# Altium project ProjetPCB.PrjPcb
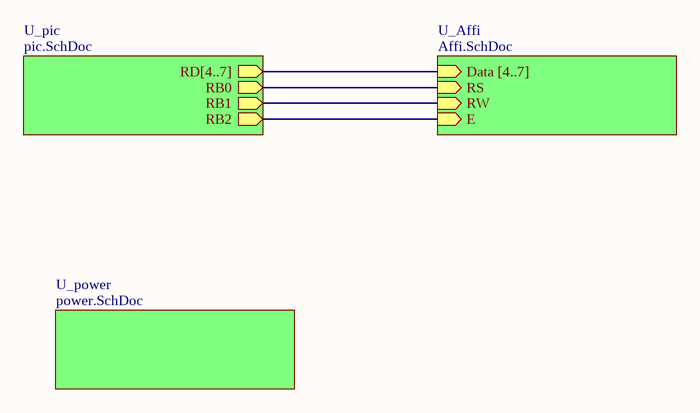
[diagram p0: temp.SchDoc]
4 sheets, 33 parts. Net scope: hierarchical (ports join the sheet entries above them; power ports are global).
Board file: PCB.PcbDoc
Sheets:
  temp.SchDoc
    U_pic = pic.SchDoc
    U_Affi = Affi.SchDoc
    U_power = power.SchDoc

## Sheet temp.SchDoc
size A4

### Sub-sheets
U_Affi = Affi.SchDoc: RS (in), RW (in), E (in), Data [4..7] (in)
U_pic = pic.SchDoc: RD[4..7] (out), RB0 (out), RB1 (out), RB2 (out)
U_power = power.SchDoc: no entries

### Nets
RB0: sheet U_pic/RB0, sheet U_Affi/RS
RB1: sheet U_pic/RB1, sheet U_Affi/RW
RB2: sheet U_pic/RB2, sheet U_Affi/E

### Buses and harness runs
bus sheet U_Affi/Data [4..7] = sheet U_pic/RD[4..7]

## Sheet pic.SchDoc
size A4
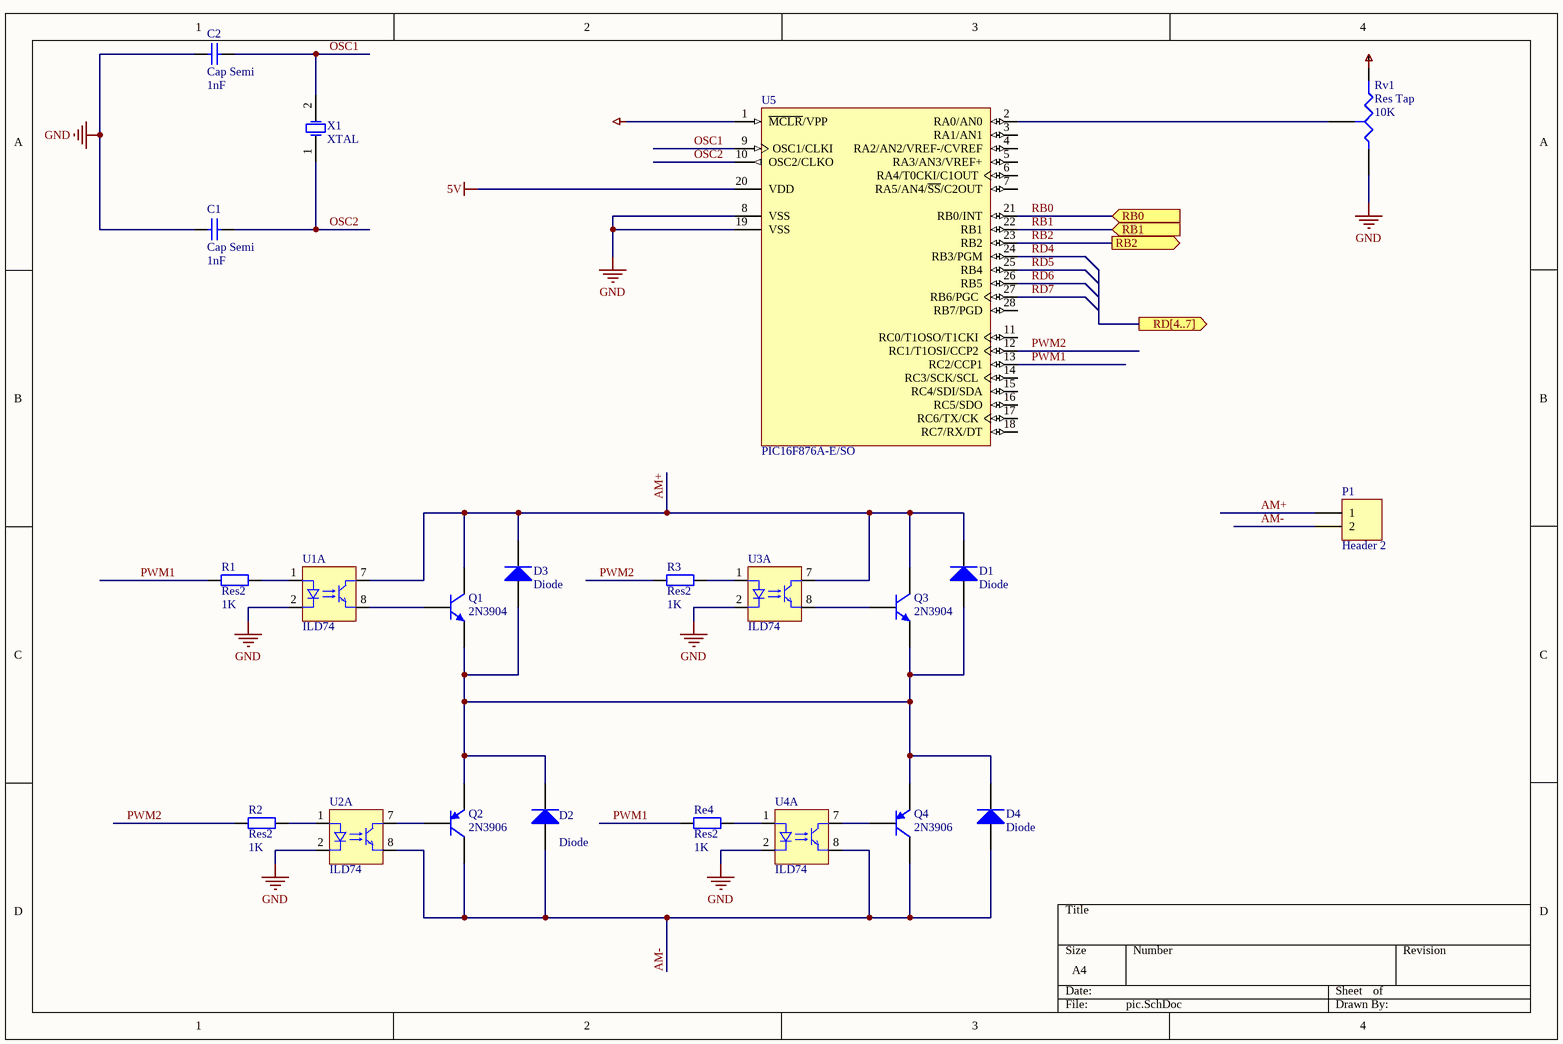
[diagram p1: pic.SchDoc]

### Parts
C1  Cap Semi  value 1nF  [C1206]
C2  Cap Semi  value 1nF  [C1206]
D1  Diode  [SMC]
D2  Diode  [SMC]
D3  Diode  [SMC]
D4  Diode  [SMC]
P1  Header 2  [HDR1X2]
Q1  2N3904  [TO-92A]
Q2  2N3906  [TO-92A]
Q3  2N3904  [TO-92A]
Q4  2N3906  [TO-92A]
R1  Res2  value 1K  [AXIAL-0.4]
R2  Res2  value 1K  [AXIAL-0.4]
R3  Res2  value 1K  [AXIAL-0.4]
Re4  Res2  value 1K  [AXIAL-0.4]
Rv1  Res Tap  value 10K  [VR3]
U1  ILD74  [DIP8]  (part A of 2)
U2  ILD74  [DIP8]  (part A of 2)
U3  ILD74  [DIP8]  (part A of 2)
U4  ILD74  [DIP8]  (part A of 2)
U5  PIC16F876A-E/SO  [SOIC-SO28_N]
X1  XTAL  [R38]

### Ports
RB0 (in), RB1 (in), RB2 (out), RD[4..7] (out)

### Nets
5V: U5.20(VDD)
GND: C1.1 C2.1 Rv1.1(A) U1.2(K) U2.2(K) U3.2(K) U4.2(K) U5.8(VSS) U5.19(VSS)
AM+: D1.2(K) D3.2(K) P1.1 Q1.3(C) Q3.3(C) U1.7(C) U3.7(C)
AM-: D2.1(A) D4.1(A) P1.2 Q2.3(C) Q4.3(C) U2.8(E) U4.8(E)
OSC1: C2.2 U5.9(OSC1/CLKI) X1.2(OSC2)
OSC2: C1.2 U5.10(OSC2/CLKO) X1.1(OSC1)
PWM1: R1.1 Re4.1 U5.13(RC2/CCP1)
PWM2: R2.1 R3.1 U5.12(RC1/T1OSI/CCP2)
RB0: U5.21(RB0/INT) ; port RB0
RB1: U5.22(RB1) ; port RB1
RB2: U5.23(RB2) ; port RB2
RD4: U5.24(RB3/PGM)
RD5: U5.25(RB4)
RD6: U5.26(RB5)
RD7: U5.27(RB6/PGC)
NetD1_1: D1.1(A) D2.2(K) D3.1(A) D4.2(K) Q1.1(E) Q2.1(E) Q3.1(E) Q4.1(E)
NetQ1_2: Q1.2(B) U1.8(E)
NetQ2_2: Q2.2(B) U2.7(C)
NetQ3_2: Q3.2(B) U3.8(E)
NetQ4_2: Q4.2(B) U4.7(C)
NetR1_2: R1.2 U1.1(A)
NetR2_2: R2.2 U2.1(A)
NetR3_2: R3.2 U3.1(A)
NetRe4_2: Re4.2 U4.1(A)
NetRv1_3: Rv1.3(TAP) U5.2(RA0/AN0)

Not connected (* = marked no-connect by the designer): Rv1 2(B); U5 1(~{MCLR}/VPP) 3(RA1/AN1) 4(RA2/AN2/VREF-/CVREF) 5(RA3/AN3/VREF+) 6(RA4/T0CKI/C1OUT) 7(RA5/AN4/~{SS}/C2OUT) 11(RC0/T1OSO/T1CKI) 14(RC3/SCK/SCL) 15(RC4/SDI/SDA) 16(RC5/SDO) 17(RC6/TX/CK) 18(RC7/RX/DT) 28(RB7/PGD)

### Library data of the parts
C1 C2 = Cap Semi: Capacitor (Semiconductor SIM Model); Published: 8-Jun-2000; LatestRevisionDate: 29-May-2009; LatestRevisionNote: IPC-7351 Footprint Added.; PackageReference: C1206; Publisher: Altium Limited; PackageDescription: Chip Capacitor
D1-D4 = Diode: Default Diode; Published: 8-Jun-2000; LatestRevisionDate: 17-Jul-2002; LatestRevisionNote: Re-released for DXP Platform.; PackageVersion: Sep-1996; PackageReference: SMC; Publisher: Altium Limited; PackageDescription: DO-214-AB/SMC; 2 C-Bend Leads; Body 7.9 x 5.9 mm, inc. leads (LxW); Code_JEDEC: DO-214-AB
P1 = Header 2: Header, 2-Pin; LatestRevisionDate: 17-Jul-2002; LatestRevisionNote: Re-released for DXP Platform.; Publisher: Altium Limited
Q1 Q3 = 2N3904: NPN General Purpose Amplifier; Published: 8-Jun-2000; LatestRevisionDate: 15-Jan-2003; LatestRevisionNote: PCB Footprint 'BCY-W3/D4.7' replaced; DatasheetVersion: 1997; PackageVersion: Sep-1998; PackageReference: TO-92A; Publisher: Altium Limited; PackageDescription: TO, Flat Index; 3 In-Line, Axial Leads; Body Dia. 4.5mm; Leads 0.51 x 0.48 mm (max); ComponentLink1Description: Manufacturer Link; ComponentLink1URL: http://www.fairchildsemi.com/; ComponentLink2Description: Datasheet; ComponentLink2URL: http://www.fairchildsemi.com/ds/2N%2F2N3904.pdf
Q2 Q4 = 2N3906: PNP General Purpose Amplifier; Published: 8-Jun-2000; LatestRevisionDate: 15-Jan-2003; LatestRevisionNote: PCB Footprint 'BCY-W3/D4.7' replaced; DatasheetVersion: 1997; PackageVersion: Sep-1998; PackageReference: TO-92A; Publisher: Altium Limited; PackageDescription: TO, Flat Index; 3 In-Line, Axial Leads; Body Dia. 4.5mm; Leads 0.51 x 0.48 mm (max); ComponentLink1Description: Manufacturer Link; ComponentLink1URL: http://www.fairchildsemi.com/; ComponentLink2Description: Datasheet; ComponentLink2URL: http://www.fairchildsemi.com/ds/2N%2F2N3906.pdf
R1-R3 Re4 = Res2: Resistor; Published: 8-Jun-2000; LatestRevisionDate: 17-Jul-2002; LatestRevisionNote: Re-released for DXP Platform.; PackageReference: AXIAL-0.4; Publisher: Altium Limited; PackageDescription: Axial Device, Thru-Hole; 2 Leads; 0.4 in Pin Spacing
Rv1 = Res Tap: Tapped Resistor; Sim Note: Enter the Resistance value and the set point into parameter fields.; Set Position: 0.5; Published: 24-Mar-1999; LatestRevisionDate: 17-Jul-2002; LatestRevisionNote: Re-released for DXP Platform.; PackageReference: VR3; Publisher: Altium Limited; PackageDescription: Variable Resistor, Thru-Hole; 3 Leads
U1-U4 = ILD74: Optocoupler, Phototransistor Output, Dual Channel, TTL Compatible, Pb-free; Note: Coupling Capacitance, 0.5 pF; Note: Transfer Ratio, 35 % Typical; Published: 6-Oct-2005; DatasheetDocument: Rev. 1.4, Oct-2004; PackageDocument: Dec-2003; PackageReference: DIP8; Publisher: Altium Limited; ComponentLink1Description: Manufacturer Link; ComponentLink1URL: http://www.vishay.com/optocouplers/list/product-83640/; ComponentLink2Description: Datasheet; ComponentLink2URL: http://www.vishay.com/docs/83640/83640.pdf
U5 = PIC16F876A-E/SO: Enhanced FLASH Microcontroller, 8K (x14-Bit words) FLASH, 368 Bytes RAM, 28-Pin SOIC, Standard VDD Range, Extended Temperature; ComponentAvailability: Unknown. Contact manufacturer to determine status.; Published: 11-Oct-2004; LatestRevisionDate: 29-Jan-2009; LatestRevisionNote: Sch. layout revised. 3D Model Removed.; DatasheetVersion: revB, Oct-2003; PackageVersion: revBB, Aug-2009; PackageReference: SOIC-SO28; Publisher: Altium Limited; PackageDescription: 28-Lead Plastic Small Outline (SO) - Wide 7.50mm Body [SOIC]; Supplier 1: Digi-Key; Supplier Part Number 1: PIC16F876A-E/SO-ND; Code_JEDEC: MS-013; ComponentLink1Description: Datasheet; ComponentLink1URL: http://ww1.microchip.com/downloads/en/DeviceDoc/39582b.pdf; ComponentLink2Description: Packaging Specification; ComponentLink2URL: http://www.microchip.com/stellent/groups/techpub_sg/documents/packagingspec/en012702.pdf; ComponentLink3Description: Microchip.com Home; ComponentLink3URL: http://www.microchip.com/
X1 = XTAL: Crystal Oscillator; Published: 8-Jun-2000; LatestRevisionDate: 17-Jul-2002; LatestRevisionNote: Re-released for DXP Platform.; PackageReference: R38; Publisher: Altium Limited; PackageDescription: Crystal, Thru-Hole; 2 Leads; Body 3.1 x 8.2 mm (Dia.xH)

## Sheet Affi.SchDoc
size A4
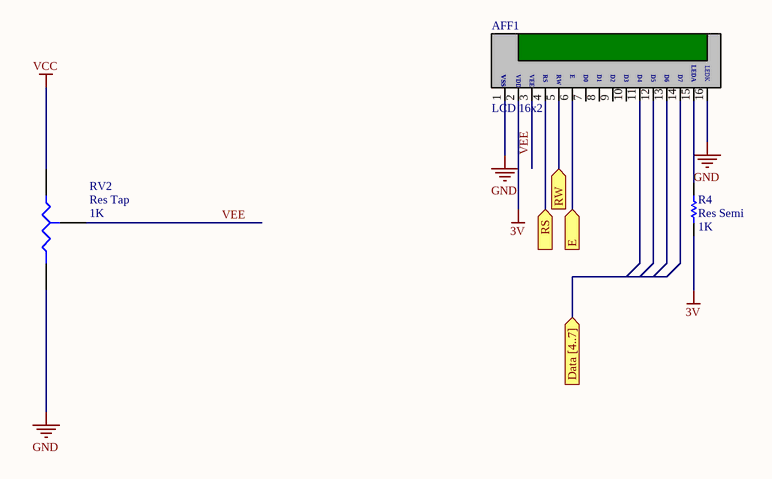
[diagram p2: Affi.SchDoc]

### Parts
AFF1  LCD 16x2  [LCRU01602DSFAWH]
R4  Res Semi  value 1K  [AXIAL-0.5]
RV2  Res Tap  value 1K  [VR3]

### Ports
Data [4..7] (in), E (in), RS (in), RW (in)

### Nets
3V: R4.1
GND: RV2.2(B)
VCC: RV2.1(A)
VEE: RV2.3(TAP)

Not connected (* = marked no-connect by the designer): R4 2

### Notes on the sheet
- (in symbol LCD 16x2) vss; VDD; VEE; RS; RW; E; D0; D1; D2; D3; D4; D5; D6; D7; LEDA; LEDK; 1; 2; 3; 4; 5; 6; 7; 8; 9; 10; 11; 12; 13; 14; 15; 16

### Library data of the parts
R4 = Res Semi: Semiconductor Resistor; Published: 8-Jun-2000; LatestRevisionDate: 17-Jul-2002; LatestRevisionNote: Re-released for DXP Platform.; PackageReference: AXIAL-0.5; Publisher: Altium Limited; PackageDescription: Axial Device, Thru-Hole; 2 Leads; 0.5 in Pin Spacing
RV2 = Res Tap: as Rv1 on sheet pic; Published: 24-Mar-1999; LatestRevisionDate: 17-Jul-2002; LatestRevisionNote: Re-released for DXP Platform.; PackageReference: VR3; Publisher: Altium Limited; PackageDescription: Variable Resistor, Thru-Hole; 3 Leads

## Sheet power.SchDoc
size A4
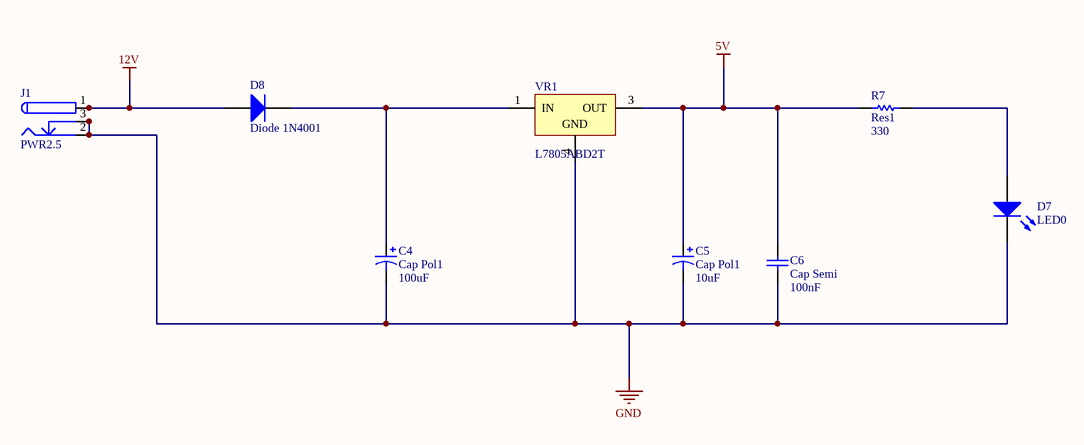
[diagram p3: power.SchDoc]

### Parts
C4  Cap Pol1  value 100uF  [RB7.6-15]
C5  Cap Pol1  value 10uF  [RB7.6-15]
C6  Cap Semi  value 100nF  [C1206]
D7  LED0  [LED-0]
D8  Diode 1N4001  [DO-41]
J1  PWR2.5  [KLD-0202]
R7  Res1  value 330  [AXIAL-0.3]
VR1  L7805ABD2T  [TO-263]

### Nets
5V: C5.1 C6.2 R7.1 VR1.3(OUT)
12V: D8.1(A) J1.1 J1.1A J1.1B
GND: C4.2 C5.2 C6.1 D7.2(K) J1.2 J1.2A J1.2B J1.3 J1.3A J1.3B VR1.4(GND)
NetC4_1: C4.1 D8.2(K) VR1.1(IN)
NetD7_1: D7.1(A) R7.2

### Library data of the parts
C4 C5 = Cap Pol1: Polarized Capacitor (Radial); Published: 8-Jun-2000; LatestRevisionDate: 17-Jul-2002; LatestRevisionNote: Re-released for DXP Platform.; PackageReference: RB7.6-15; Publisher: Altium Limited; PackageDescription: Polarized Capacitor (Radial); 2 Leads
C6 = Cap Semi: Capacitor (Semiconductor SIM Model); Published: 8-Jun-2000; LatestRevisionDate: 29-May-2009; LatestRevisionNote: IPC-7351 Footprint Added.; PackageReference: C1206; Publisher: Altium Limited; PackageDescription: Chip Capacitor
D7 = LED0: Typical INFRARED GaAs LED; Published: 8-Jun-2000; LatestRevisionDate: 08-Jul-2005; LatestRevisionNote: Mech Layer 1 removed.; PackageReference: LED-0; Publisher: Altium Limited; PackageDescription: LED; 2 Leads
D8 = Diode 1N4001: 1 Amp General Purpose Rectifier; Published: 8-Jun-2000; LatestRevisionDate: 17-Jul-2002; LatestRevisionNote: Re-released for DXP Platform.; DatasheetVersion: 1998; PackageVersion: Aug-1999; PackageReference: DO-41; Publisher: Altium Limited; PackageDescription: Diode, Axial; Body 5.2 x 2.7 mm (LxDia. max), Lead Dia. 0.86 mm (max); Code_JEDEC: DO-204-AL; ComponentLink1Description: Manufacturer Link; ComponentLink1URL: http://www.fairchildsemi.com/; ComponentLink2Description: Datasheet; ComponentLink2URL: http://www.fairchildsemi.com/ds/1N%2F1N4001.pdf
J1 = PWR2.5: Low Voltage Power Supply Connector; Published: 17-Dec-2003; DatasheetDocument: 09-May-2002; Publisher: Altium Limited; ComponentLink1Description: Manufacturer Link; ComponentLink1URL: http://domino.kycon.com/internet/Products.html
R7 = Res1: Resistor; Published: 8-Jun-2000; LatestRevisionDate: 17-Jul-2002; LatestRevisionNote: Re-released for DXP Platform.; PackageReference: AXIAL-0.3; Publisher: Altium Limited; PackageDescription: Axial Device, Thru-Hole; 2 Leads; 0.3 in Pin Spacing
VR1 = L7805ABD2T: Precision 1A Regulator; Published: 24-Aug-2001; LatestRevisionDate: 17-Jul-2002; LatestRevisionNote: Re-released for DXP Platform.; DatasheetVersion: Nov-1999; PackageReference: TO-263; Publisher: Altium Limited; PackageDescription: D2-PAK/TO-263-AB; 3 Leads (1 Cropped); Body 15.9 (inc. leads) x 10.4 mm (LxW max); ComponentLink1Description: Manufacturer Link; ComponentLink1URL: http://www.st.com/; ComponentLink2Description: Datasheet; ComponentLink2URL: http://www.st.com/stonline/products/literature/ds/2144/l7805ab.pdf

## Nets that join several sheets
5V: pic (U5.20), power (C5.1 C6.2 R7.1 VR1.3)
GND: pic (9 pins), Affi (RV2.2), power (11 pins)